# Altium project PROC154E3_SCH.PrjPcb (part 41 of 60)

## Sheet 46. QUAD PORT CONSOLE.SchDoc: QUAD PORT UART
size 513 x 386 mm; Project: PROC154E2(001)_SK_AM69; Issue: 1.0; RevCode: E3; Page Create Date: March  8, 1995; Variant Name: Core Design; Schematic Page Number: 46; Page Number: 46; Page Size: C; Comment: MISTRAL_TITLEBLK_CSIZE_1; Page Count: 62; Schematic Page Count: 62; Name: PROC154E2 001 SK AM69; DsnPath: C:\Users\danie\Downloads\sprr466c\PROC154E3_RP\PROC154E3_SCH.DSN; SchematicName: SCHEMATIC1; PageName: 46. QUAD PORT CONSOLE; PageSize: C; TopSchematic: True
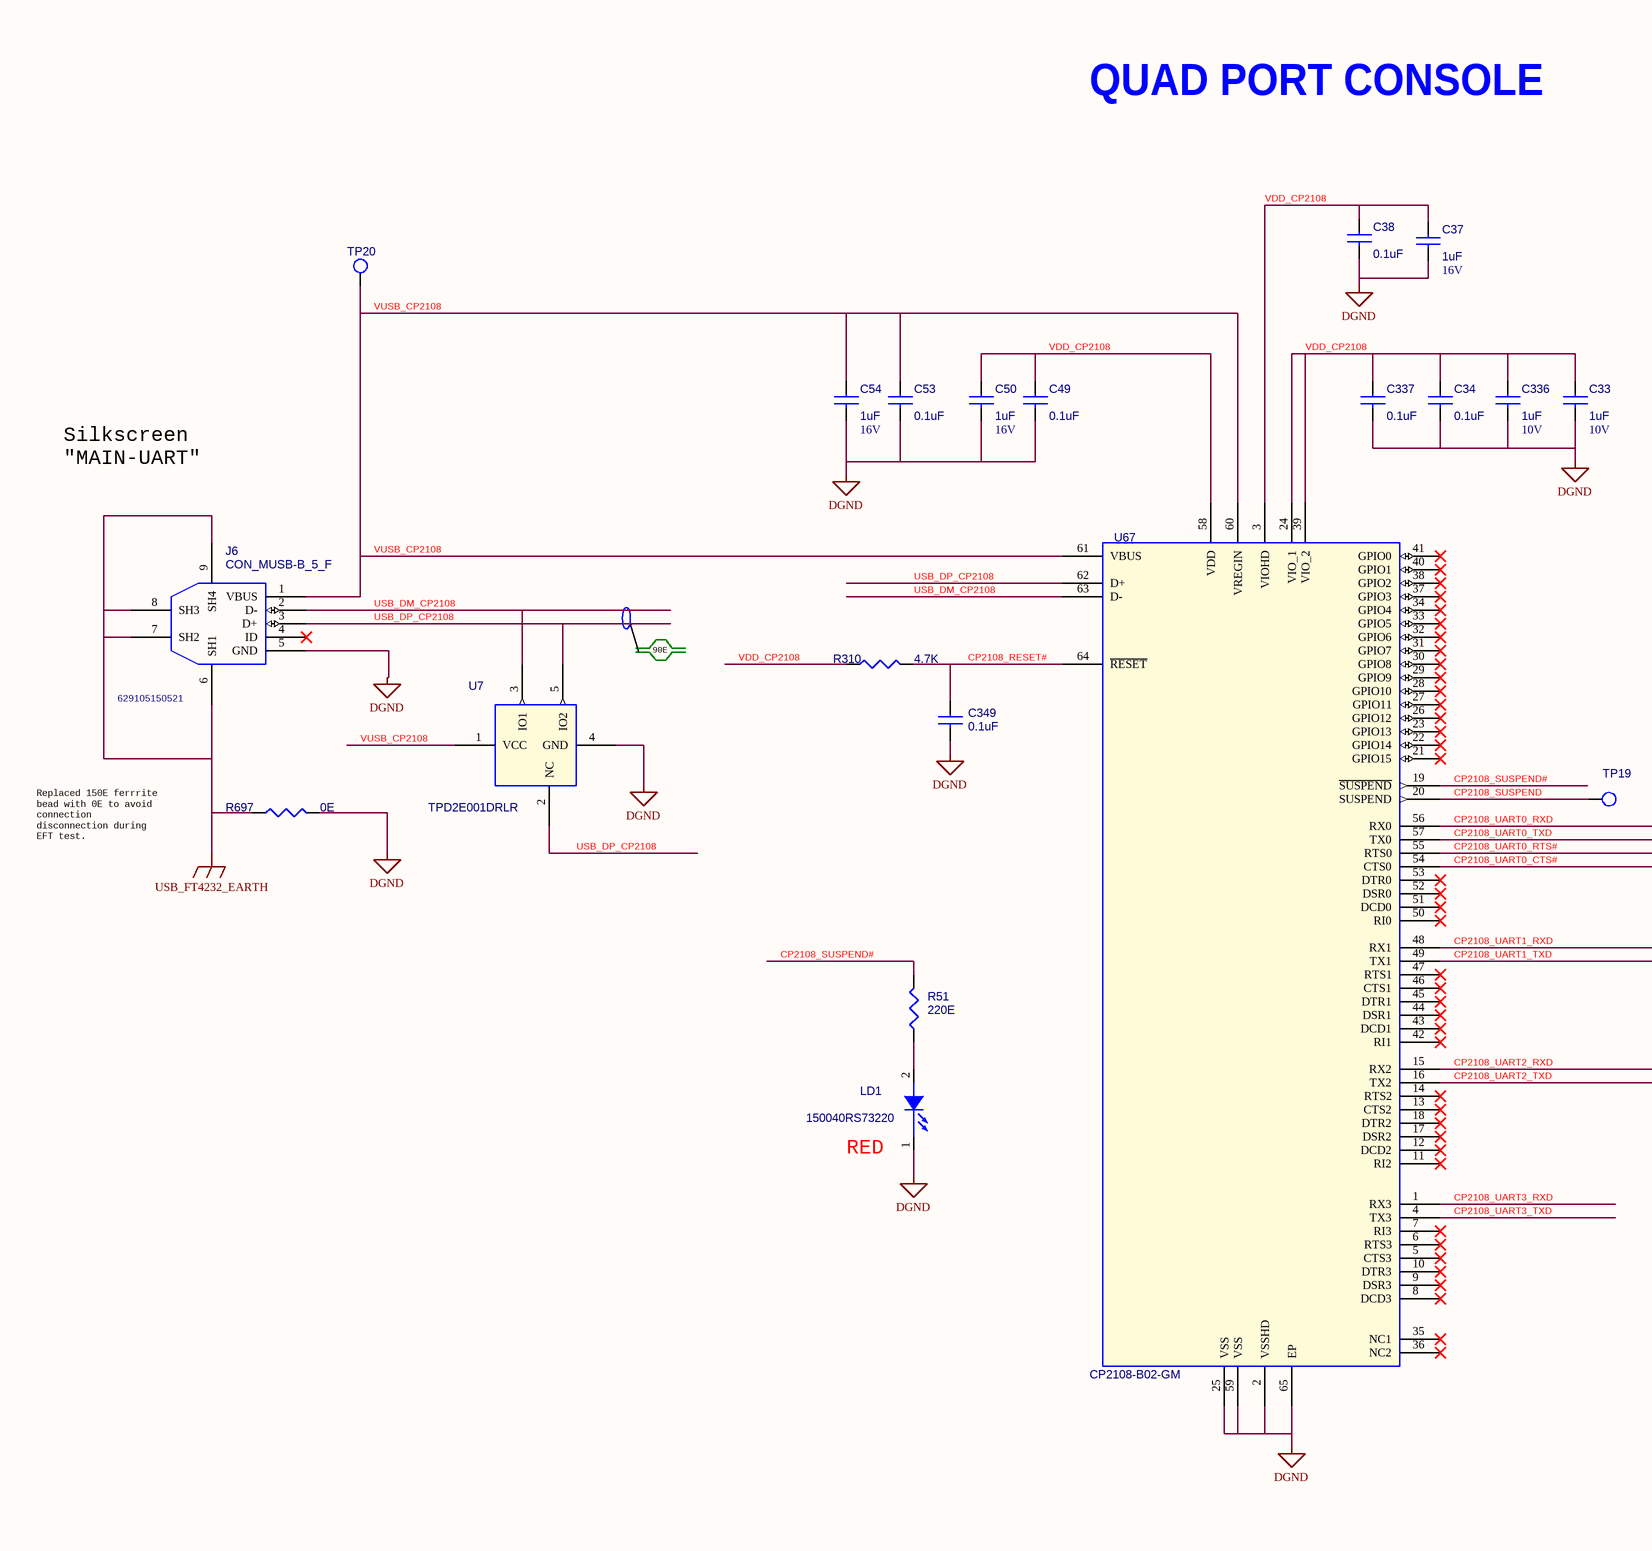
[diagram p76: 46. QUAD PORT CONSOLE.SchDoc, left]
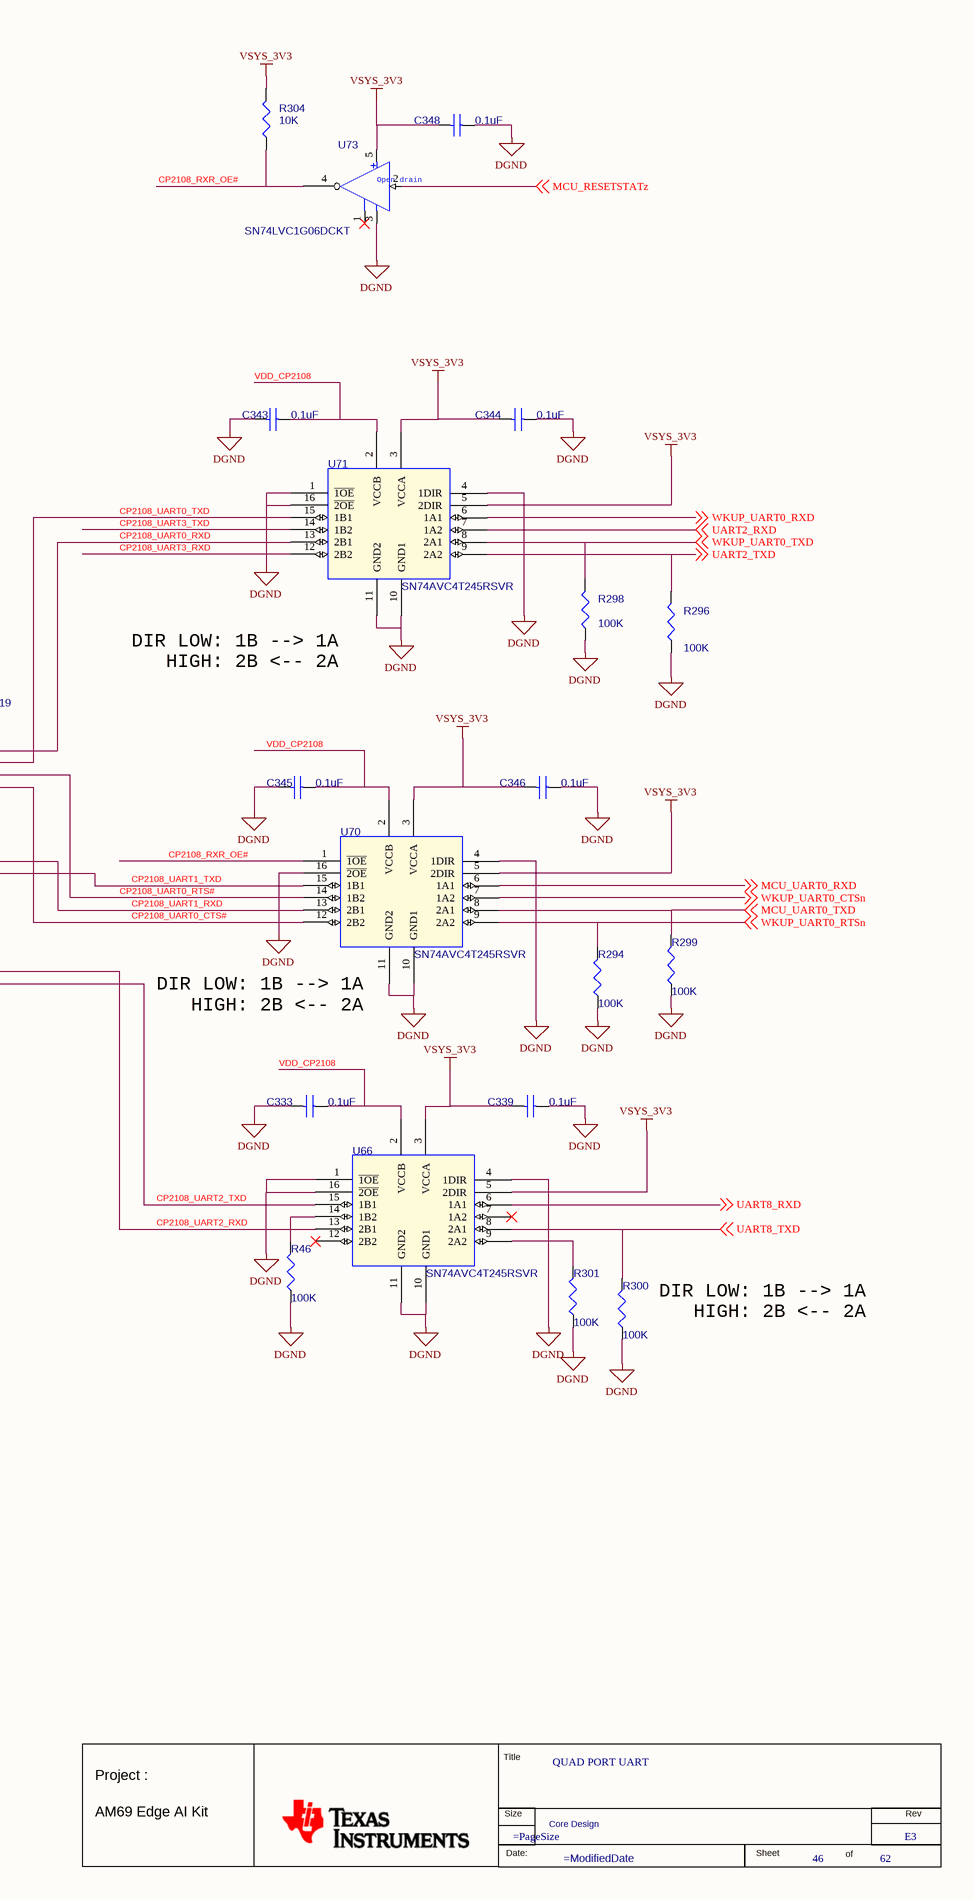
[diagram p77: 46. QUAD PORT CONSOLE.SchDoc, right]

### Parts
(Parts that share a designator on the sheet are numbered #1, #2 ... from top to bottom, then left to right.)
*#46  RevCode: E3  Title: QUAD PORT UART  Page Number: 46  Page Count: 62  Variant Name: Core Design  (hidden comment: MISTRAL_TITLEBLK_CSIZE_1)  (graphical)
C33  1uF  Voltage: 10V  [CAP0402_0-75]
C34  0.1uF  [CAP0201_0-5]
C37  1uF  Voltage: 16V  [CAP0201_0-5]
C38  0.1uF  [CAP0201_0-5]
C49  0.1uF  [CAP0201_0-5]
C50  1uF  Voltage: 16V  [CAP0201_0-5]
C53  0.1uF  [CAP0201_0-5]
C54  1uF  Voltage: 16V  [CAP0201_0-5]
C333  0.1uF  [CAP0201_0-5]
C336  1uF  Voltage: 10V  [CAP0402_0-75]
C337  0.1uF  [CAP0201_0-5]
C339  0.1uF  [CAP0201_0-5]
C343  0.1uF  [CAP0201_0-5]
C344  0.1uF  [CAP0201_0-5]
C345  0.1uF  [CAP0201_0-5]
C346  0.1uF  [CAP0201_0-5]
C348  0.1uF  [CAP0201_0-5]
C349  0.1uF  [CAP0201_0-5]
J6  CON_MUSB-B_5_F  Mfr_part_number: 629105150521  [CON_MUSBB5_629105150521_S_R_S_2-7]
LD1  150040RS73220  [LED_150040GS73220_40X20_SMD_0-4]
R46  100K  [RES0402_0-5]
R51  220E  [RES0402_0-5]
R294  100K  [RES0402_0-5]
R296  100K  [RES0402_0-5]
R298  100K  [RES0402_0-5]
R299  100K  [RES0402_0-5]
R300  100K  [RES0402_0-5]
R301  100K  [RES0402_0-5]
R304  10K  [RES0402_0-5]
R310  4.7K  [RES0201_0-5]
R697  0E  [RES0805_0-75]
TP19  TP30_SMD  [TP30_SMD]  (value not drawn)
TP20  TP30_SMD  [TP30_SMD]  (value not drawn)
U7  TPD2E001DRLR  [SOT553-5_0-6]
U66  SN74AVC4T245RSVR  [UQFN16_TMUX1574_70X100_0-6]
U67  CP2108-B02-GM  [QFN64_19-68_360X360]
U70  SN74AVC4T245RSVR  [UQFN16_TMUX1574_70X100_0-6]
U71  SN74AVC4T245RSVR  [UQFN16_TMUX1574_70X100_0-6]
U73  SN74LVC1G06DCKT  [SC70-5_1-1]

### Nets
DGND: C33.2 C34.2 C37.2 C38.2 C49.2 C50.2 C53.2 C54.2 C333.2 C336.2 C337.2 C339.1 C343.2 C344.1 C345.2 C346.1 C348.1 C349.2 J6.5(GND) LD1.1(CATHODE) R46.1 R294.1 R296.1 R298.1 R299.1 R300.1 R301.1 R697.2 U7.4(GND) U66.1(~{1OE}) U66.4(1DIR) U66.10(GND1) U66.11(GND2) U66.16(~{2OE}) U67.2(VSSHD) U67.25(VSS) U67.59(VSS) U67.65(EP) U70.4(1DIR) U70.10(GND1) U70.11(GND2) U70.16(~{2OE}) U71.1(~{1OE}) U71.4(1DIR) U71.10(GND1) U71.11(GND2) U71.16(~{2OE}) U73.3(GND)  [project net VDD_CPU_HCPS_GOSNS]
USB_FT4232_EARTH: J6.6(SH1) J6.7(SH2) J6.8(SH3) J6.9(SH4) R697.1
VSYS_3V3: C339.2 C344.2 C346.2 C348.2 R304.2 U66.3(VCCA) U66.5(2DIR) U70.3(VCCA) U70.5(2DIR) U71.3(VCCA) U71.5(2DIR) U73.5(VCC)  [project net V_3V3]
CP2108_RESET#: C349.1 R310.2 U67.64(~{RESET})
CP2108_RXR_OE#: R304.1 U70.1(~{1OE}) U73.4(OUT)
CP2108_SUSPEND: TP19.1(TP) U67.20(SUSPEND)
CP2108_SUSPEND#: R51.2 U67.19(~{SUSPEND})
CP2108_UART0_CTS#: U67.54(CTS0) U70.12(2B2)
CP2108_UART0_RTS#: U67.55(RTS0) U70.14(1B2)
CP2108_UART0_RXD: U67.56(RX0) U71.13(2B1)
CP2108_UART0_TXD: U67.57(TX0) U71.15(1B1)
CP2108_UART1_RXD: U67.48(RX1) U70.13(2B1)
CP2108_UART1_TXD: U67.49(TX1) U70.15(1B1)
CP2108_UART2_RXD: U66.13(2B1) U67.15(RX2)
CP2108_UART2_TXD: U66.15(1B1) U67.16(TX2)
CP2108_UART3_RXD: U67.1(RX3) U71.12(2B2)
CP2108_UART3_TXD: U67.4(TX3) U71.14(1B2)
MCU_RESETSTATZ: U73.2(IN_A) ; off-sheet MCU_RESETSTATz
MCU_UART0_RXD: U70.6(1A1) ; off-sheet MCU_UART0_RXD
MCU_UART0_TXD: R299.2 U70.8(2A1) ; off-sheet MCU_UART0_TXD
UART2_RXD: U71.7(1A2) ; off-sheet UART2_RXD
UART2_TXD: R296.2 U71.9(2A2) ; off-sheet UART2_TXD
UART8_RXD: U66.6(1A1) ; off-sheet UART8_RXD
UART8_TXD: R300.2 U66.8(2A1) ; off-sheet UART8_TXD
USB_DM_CP2108: J6.2(D-) U7.3(IO1) U67.63(D-)
USB_DP_CP2108: J6.3(D+) U7.2(NC) U7.5(IO2) U67.62(D+)
VDD_CP2108: C33.1 C34.1 C37.1 C38.1 C49.1 C50.1 C333.1 C336.1 C337.1 C343.1 C345.1 R310.1 U66.2(VCCB) U67.3(VIOHD) U67.24(VIO_1) U67.39(VIO_2) U67.58(VDD) U70.2(VCCB) U71.2(VCCB)
VUSB_CP2108: C53.1 C54.1 J6.1(VBUS) TP20.1(TP) U7.1(VCC) U67.60(VREGIN) U67.61(VBUS)
WKUP_UART0_CTSn: U70.7(1A2) ; off-sheet WKUP_UART0_CTSn
WKUP_UART0_RTSn: R294.2 U70.9(2A2) ; off-sheet WKUP_UART0_RTSn
WKUP_UART0_RXD: U71.6(1A1) ; off-sheet WKUP_UART0_RXD
WKUP_UART0_TXD: R298.2 U71.8(2A1) ; off-sheet WKUP_UART0_TXD
NetLD1_2: LD1.2(ANODE) R51.1
NetR46_2: R46.2 U66.14(1B2)
NetR301_2: R301.2 U66.9(2A2)

Not connected (* = marked no-connect by the designer): J6 4(ID)*; U66 7(1A2)* 12(2B2)*; U67 5(CTS3)* 6(RTS3)* 7(RI3)* 8(DCD3)* 9(DSR3)* 10(DTR3)* 11(RI2)* 12(DCD2)* 13(CTS2)* 14(RTS2)* 17(DSR2)* 18(DTR2)* 21(GPIO15)* 22(GPIO14)* 23(GPIO13)* 26(GPIO12)* 27(GPIO11)* 28(GPIO10)* 29(GPIO9)* 30(GPIO8)* 31(GPIO7)* 32(GPIO6)* 33(GPIO5)* 34(GPIO4)* 35(NC1)* 36(NC2)* 37(GPIO3)* 38(GPIO2)* 40(GPIO1)* 41(GPIO0)* 42(RI1)* 43(DCD1)* 44(DSR1)* 45(DTR1)* 46(CTS1)* 47(RTS1)* 50(RI0)* 51(DCD0)* 52(DSR0)* 53(DTR0)*; U73 1(NC)*

### Notes on the sheet
- QUAD PORT CONSOLE
- Silkscreen
  "MAIN-UART"
- 90E
- DIR LOW: 1B --> 1A
  HIGH: 2B <-- 2A
- Replaced 150E ferrrite
  bead with 0E to avoid
  connection
  disconnection during
  EFT test.
- (near U70) DIR LOW: 1B --> 1A
  HIGH: 2B <-- 2A
- (near LD1) RED
- (near R300) DIR LOW: 1B --> 1A
  HIGH: 2B <-- 2A
- (in symbol MISTRAL_TITLEBLK_CSIZE_1) Title; Project :; Size; Rev; AM69 Edge AI Kit; Date:; Sheet; of
- (in symbol SN74LVC1G06DCKT_SC70-5) Open drain

### Library data of the parts
*#46 = MISTRAL_TITLEBLK_CSIZE_1: as *#44 on sheet 44. SGMII EXPANSION HDR; Page Create Date: March  8, 1995; Page Size: =PageSize; Page Modify Date: =ModifiedDate; Schematic Page Count: 62; Schematic Page Number: 46
C33 = CAP_Dup1: CAP CERAMIC 1uF 10V 10% X7S AUTO 0402; Part Reference: C33; Part_type: CAPACITORS\CERAMIC; Mfr_part_number: GCM155C71A105KE38D; Mfr_name: MURATA; Mistral Part No: 120018090021-R; Custom_Duty: 15%; Customs_HS_Code: 85322990; Wattage: NA; Project: SMART-M_SCRIPTALK_PB; Value: 1uF; PCB Footprint: CAP0402_0-75; Chkd/date: MANIRAJA/100918; Crtd /date: ALVY/100918; Datasheet: Y:\MIS_DATABASE\DATASHEETS\CAPACITORS\MURATA-GCM-SER.PDF; Temperature: -55°C+125°C; Weight: 6mg; Height: 0.70MM; Distributor_part_number: 490-13409-1-ND; Distributor_name: DIGIKEY; Package: 0402; Tolerance: 10%; Library Ref: CAP; MECHANICAL 3D STEP FILE: CAP0402_0-75; Footprint Ref: CAP0402_0-75; Library Path: Y:\MIS_DATABASE\Library\ALTIUM_TOOL\SCHEMATICS_PARTS\MS_DISCRETE_Library.schlib; Footprint Path: Y:\MIS_DATABASE\Library\ALTIUM_TOOL\PCB_FOOTPRINTS\Altium_Footprint_Lib.PcbLib
C34 = CAP_Dup1: CAP CERAMIC 0.1uF 16V 10% X7S AUTO 0201; Part Reference: C34; Part_type: CAPACITORS\CERAMIC; Mfr_part_number: GRT033C71C104KE01D; Mfr_name: MURATA; Mistral Part No: 120021030007-R; Custom_Duty: 15%; Customs_HS_Code: 85322990; Wattage: NA; Project: J7ES_SK_BRD; Value: 0.1uF; PCB Footprint: CAP0201_0-5; MECHANICAL 3D STEP FILE: CAP0201_0-5; Chkd/date: MANIRAJA/110321; Crtd /date: ALVY/110321; Datasheet: Y:\MIS_DATABASE\DATASHEETS\CAPACITORS\GRT033C71C104KE01.PDF; Temperature: -55°C+125°C; Weight: 330mg; Height: 0.33MM; Distributor_part_number: 490-GRT033C71C104KE01DTR-ND; Distributor_name: DIGIKEY; Package: 0201; Voltage: 16V; Tolerance: 10%
C37 = CAP_Dup1: CAP CERAMIC 1uF 16V 20% X5R 0201; Part Reference: C37; Mistral Part No: 120018090038-R; Mfr_name: SAMSUNG; Mfr_part_number: CL03A105MO3NRNH; Part_type: CAPACITORS\CERAMIC; Project: TI_60GHz-AOP; Wattage: NA; Customs_HS_Code: 85322990; Custom_Duty: 15%; Value: 1uF; PCB Footprint: CAP0201_0-5; Footprint Path: Y:\MIS_DATABASE\Library\ALTIUM_TOOL\PCB_FOOTPRINTS\Altium_Footprint_Lib.PcbLib; Library Path: Y:\MIS_DATABASE\Library\ALTIUM_TOOL\SCHEMATICS_PARTS\MS_DISCRETE_Library.schlib; Footprint Ref: CAP0201_0-5; MECHANICAL 3D STEP FILE: CAP0201_0-5; Library Ref: CAP; Tolerance: 20%; Package: 0201; Distributor_name: DIGIKEY; Distributor_part_number: 1276-6798-1-ND; Height: 0.39MM; Weight: 0.17mg; Temperature: -55°C+85°C; Datasheet: Y:\MIS_DATABASE\DATASHEETS\CAPACITORS\CL03A105MO3NRNH.PDF; Crtd /date: MANIRAJA/220918; Chkd/date: MANIRAJA/220918
C38 = CAP_Dup1: CAP CERAMIC 0.1uF 16V 10% X7S AUTO 0201; Part Reference: C38; Part_type: CAPACITORS\CERAMIC; Mfr_part_number: GRT033C71C104KE01D; Mfr_name: MURATA; Mistral Part No: 120021030007-R; Custom_Duty: 15%; Customs_HS_Code: 85322990; Wattage: NA; Project: J7ES_SK_BRD; Value: 0.1uF; PCB Footprint: CAP0201_0-5; MECHANICAL 3D STEP FILE: CAP0201_0-5; Chkd/date: MANIRAJA/110321; Crtd /date: ALVY/110321; Datasheet: Y:\MIS_DATABASE\DATASHEETS\CAPACITORS\GRT033C71C104KE01.PDF; Temperature: -55°C+125°C; Weight: 330mg; Height: 0.33MM; Distributor_part_number: 490-GRT033C71C104KE01DTR-ND; Distributor_name: DIGIKEY; Package: 0201; Voltage: 16V; Tolerance: 10%
C49 = CAP_Dup1: CAP CERAMIC 0.1uF 16V 10% X7S AUTO 0201; Part Reference: C49; Part_type: CAPACITORS\CERAMIC; Mfr_part_number: GRT033C71C104KE01D; Mfr_name: MURATA; Mistral Part No: 120021030007-R; Custom_Duty: 15%; Customs_HS_Code: 85322990; Wattage: NA; Project: J7ES_SK_BRD; Value: 0.1uF; PCB Footprint: CAP0201_0-5; MECHANICAL 3D STEP FILE: CAP0201_0-5; Chkd/date: MANIRAJA/110321; Crtd /date: ALVY/110321; Datasheet: Y:\MIS_DATABASE\DATASHEETS\CAPACITORS\GRT033C71C104KE01.PDF; Temperature: -55°C+125°C; Weight: 330mg; Height: 0.33MM; Distributor_part_number: 490-GRT033C71C104KE01DTR-ND; Distributor_name: DIGIKEY; Package: 0201; Voltage: 16V; Tolerance: 10%
C50 = CAP_Dup1: CAP CERAMIC 1uF 16V 20% X5R 0201; Part Reference: C50; Mistral Part No: 120018090038-R; Mfr_name: SAMSUNG; Mfr_part_number: CL03A105MO3NRNH; Part_type: CAPACITORS\CERAMIC; Project: TI_60GHz-AOP; Wattage: NA; Customs_HS_Code: 85322990; Custom_Duty: 15%; Value: 1uF; PCB Footprint: CAP0201_0-5; Footprint Path: Y:\MIS_DATABASE\Library\ALTIUM_TOOL\PCB_FOOTPRINTS\Altium_Footprint_Lib.PcbLib; Library Path: Y:\MIS_DATABASE\Library\ALTIUM_TOOL\SCHEMATICS_PARTS\MS_DISCRETE_Library.schlib; Footprint Ref: CAP0201_0-5; MECHANICAL 3D STEP FILE: CAP0201_0-5; Library Ref: CAP; Tolerance: 20%; Package: 0201; Distributor_name: DIGIKEY; Distributor_part_number: 1276-6798-1-ND; Height: 0.39MM; Weight: 0.17mg; Temperature: -55°C+85°C; Datasheet: Y:\MIS_DATABASE\DATASHEETS\CAPACITORS\CL03A105MO3NRNH.PDF; Crtd /date: MANIRAJA/220918; Chkd/date: MANIRAJA/220918
C53 = CAP_Dup1: CAP CERAMIC 0.1uF 16V 10% X7S AUTO 0201; Part Reference: C53; Mistral Part No: 120021030007-R; Mfr_name: MURATA; Mfr_part_number: GRT033C71C104KE01D; Part_type: CAPACITORS\CERAMIC; Project: J7ES_SK_BRD; Wattage: NA; Customs_HS_Code: 85322990; Custom_Duty: 15%; Value: 0.1uF; PCB Footprint: CAP0201_0-5; Tolerance: 10%; Voltage: 16V; Package: 0201; Distributor_name: DIGIKEY; Distributor_part_number: 490-GRT033C71C104KE01DTR-ND; Height: 0.33MM; Weight: 330mg; Temperature: -55°C+125°C; Datasheet: Y:\MIS_DATABASE\DATASHEETS\CAPACITORS\GRT033C71C104KE01.PDF; Crtd /date: ALVY/110321; Chkd/date: MANIRAJA/110321; MECHANICAL 3D STEP FILE: CAP0201_0-5
C54 = CAP_Dup1: CAP CERAMIC 1uF 16V 20% X5R 0201; Part Reference: C54; Mistral Part No: 120018090038-R; Mfr_name: SAMSUNG; Mfr_part_number: CL03A105MO3NRNH; Part_type: CAPACITORS\CERAMIC; Project: TI_60GHz-AOP; Wattage: NA; Customs_HS_Code: 85322990; Custom_Duty: 15%; Value: 1uF; PCB Footprint: CAP0201_0-5; Footprint Path: Y:\MIS_DATABASE\Library\ALTIUM_TOOL\PCB_FOOTPRINTS\Altium_Footprint_Lib.PcbLib; Library Path: Y:\MIS_DATABASE\Library\ALTIUM_TOOL\SCHEMATICS_PARTS\MS_DISCRETE_Library.schlib; Footprint Ref: CAP0201_0-5; MECHANICAL 3D STEP FILE: CAP0201_0-5; Library Ref: CAP; Tolerance: 20%; Package: 0201; Distributor_name: DIGIKEY; Distributor_part_number: 1276-6798-1-ND; Height: 0.39MM; Weight: 0.17mg; Temperature: -55°C+85°C; Datasheet: Y:\MIS_DATABASE\DATASHEETS\CAPACITORS\CL03A105MO3NRNH.PDF; Crtd /date: MANIRAJA/220918; Chkd/date: MANIRAJA/220918
C333 = CAP_Dup1: CAP CERAMIC 0.1uF 16V 10% X7S AUTO 0201; Part Reference: C333; Part_type: CAPACITORS\CERAMIC; Mfr_part_number: GRT033C71C104KE01D; Mfr_name: MURATA; Mistral Part No: 120021030007-R; Custom_Duty: 15%; Customs_HS_Code: 85322990; Wattage: NA; Project: J7ES_SK_BRD; Value: 0.1uF; PCB Footprint: CAP0201_0-5; MECHANICAL 3D STEP FILE: CAP0201_0-5; Chkd/date: MANIRAJA/110321; Crtd /date: ALVY/110321; Datasheet: Y:\MIS_DATABASE\DATASHEETS\CAPACITORS\GRT033C71C104KE01.PDF; Temperature: -55°C+125°C; Weight: 330mg; Height: 0.33MM; Distributor_part_number: 490-GRT033C71C104KE01DTR-ND; Distributor_name: DIGIKEY; Package: 0201; Voltage: 16V; Tolerance: 10%
C336 = CAP_Dup1: CAP CERAMIC 1uF 10V 10% X7S AUTO 0402; Part Reference: C336; Part_type: CAPACITORS\CERAMIC; Mfr_part_number: GCM155C71A105KE38D; Mfr_name: MURATA; Mistral Part No: 120018090021-R; Custom_Duty: 15%; Customs_HS_Code: 85322990; Wattage: NA; Project: SMART-M_SCRIPTALK_PB; Value: 1uF; PCB Footprint: CAP0402_0-75; Chkd/date: MANIRAJA/100918; Crtd /date: ALVY/100918; Datasheet: Y:\MIS_DATABASE\DATASHEETS\CAPACITORS\MURATA-GCM-SER.PDF; Temperature: -55°C+125°C; Weight: 6mg; Height: 0.70MM; Distributor_part_number: 490-13409-1-ND; Distributor_name: DIGIKEY; Package: 0402; Tolerance: 10%; Library Ref: CAP; MECHANICAL 3D STEP FILE: CAP0402_0-75; Footprint Ref: CAP0402_0-75; Library Path: Y:\MIS_DATABASE\Library\ALTIUM_TOOL\SCHEMATICS_PARTS\MS_DISCRETE_Library.schlib; Footprint Path: Y:\MIS_DATABASE\Library\ALTIUM_TOOL\PCB_FOOTPRINTS\Altium_Footprint_Lib.PcbLib
C337 = CAP_Dup1: CAP CERAMIC 0.1uF 16V 10% X7S AUTO 0201; Part Reference: C337; Mistral Part No: 120021030007-R; Mfr_name: MURATA; Mfr_part_number: GRT033C71C104KE01D; Part_type: CAPACITORS\CERAMIC; Project: J7ES_SK_BRD; Wattage: NA; Customs_HS_Code: 85322990; Custom_Duty: 15%; Value: 0.1uF; PCB Footprint: CAP0201_0-5; Tolerance: 10%; Voltage: 16V; Package: 0201; Distributor_name: DIGIKEY; Distributor_part_number: 490-GRT033C71C104KE01DTR-ND; Height: 0.33MM; Weight: 330mg; Temperature: -55°C+125°C; Datasheet: Y:\MIS_DATABASE\DATASHEETS\CAPACITORS\GRT033C71C104KE01.PDF; Crtd /date: ALVY/110321; Chkd/date: MANIRAJA/110321; MECHANICAL 3D STEP FILE: CAP0201_0-5
C339 = CAP_Dup1: CAP CERAMIC 0.1uF 16V 10% X7S AUTO 0201; Part Reference: C339; Mistral Part No: 120021030007-R; Mfr_name: MURATA; Mfr_part_number: GRT033C71C104KE01D; Part_type: CAPACITORS\CERAMIC; Project: J7ES_SK_BRD; Wattage: NA; Customs_HS_Code: 85322990; Custom_Duty: 15%; Value: 0.1uF; PCB Footprint: CAP0201_0-5; Tolerance: 10%; Voltage: 16V; Package: 0201; Distributor_name: DIGIKEY; Distributor_part_number: 490-GRT033C71C104KE01DTR-ND; Height: 0.33MM; Weight: 330mg; Temperature: -55°C+125°C; Datasheet: Y:\MIS_DATABASE\DATASHEETS\CAPACITORS\GRT033C71C104KE01.PDF; Crtd /date: ALVY/110321; Chkd/date: MANIRAJA/110321; MECHANICAL 3D STEP FILE: CAP0201_0-5
C343 = CAP_Dup1: CAP CERAMIC 0.1uF 16V 10% X7S AUTO 0201; Part Reference: C343; Mistral Part No: 120021030007-R; Mfr_name: MURATA; Mfr_part_number: GRT033C71C104KE01D; Part_type: CAPACITORS\CERAMIC; Project: J7ES_SK_BRD; Wattage: NA; Customs_HS_Code: 85322990; Custom_Duty: 15%; Value: 0.1uF; PCB Footprint: CAP0201_0-5; Tolerance: 10%; Voltage: 16V; Package: 0201; Distributor_name: DIGIKEY; Distributor_part_number: 490-GRT033C71C104KE01DTR-ND; Height: 0.33MM; Weight: 330mg; Temperature: -55°C+125°C; Datasheet: Y:\MIS_DATABASE\DATASHEETS\CAPACITORS\GRT033C71C104KE01.PDF; Crtd /date: ALVY/110321; Chkd/date: MANIRAJA/110321; MECHANICAL 3D STEP FILE: CAP0201_0-5
C344 = CAP_Dup1: CAP CERAMIC 0.1uF 16V 10% X7S AUTO 0201; Part Reference: C344; Mistral Part No: 120021030007-R; Mfr_name: MURATA; Mfr_part_number: GRT033C71C104KE01D; Part_type: CAPACITORS\CERAMIC; Project: J7ES_SK_BRD; Wattage: NA; Customs_HS_Code: 85322990; Custom_Duty: 15%; Value: 0.1uF; PCB Footprint: CAP0201_0-5; Tolerance: 10%; Voltage: 16V; Package: 0201; Distributor_name: DIGIKEY; Distributor_part_number: 490-GRT033C71C104KE01DTR-ND; Height: 0.33MM; Weight: 330mg; Temperature: -55°C+125°C; Datasheet: Y:\MIS_DATABASE\DATASHEETS\CAPACITORS\GRT033C71C104KE01.PDF; Crtd /date: ALVY/110321; Chkd/date: MANIRAJA/110321; MECHANICAL 3D STEP FILE: CAP0201_0-5
C345 = CAP_Dup1: CAP CERAMIC 0.1uF 16V 10% X7S AUTO 0201; Part Reference: C345; Mistral Part No: 120021030007-R; Mfr_name: MURATA; Mfr_part_number: GRT033C71C104KE01D; Part_type: CAPACITORS\CERAMIC; Project: J7ES_SK_BRD; Wattage: NA; Customs_HS_Code: 85322990; Custom_Duty: 15%; Value: 0.1uF; PCB Footprint: CAP0201_0-5; Tolerance: 10%; Voltage: 16V; Package: 0201; Distributor_name: DIGIKEY; Distributor_part_number: 490-GRT033C71C104KE01DTR-ND; Height: 0.33MM; Weight: 330mg; Temperature: -55°C+125°C; Datasheet: Y:\MIS_DATABASE\DATASHEETS\CAPACITORS\GRT033C71C104KE01.PDF; Crtd /date: ALVY/110321; Chkd/date: MANIRAJA/110321; MECHANICAL 3D STEP FILE: CAP0201_0-5
C346 = CAP_Dup1: CAP CERAMIC 0.1uF 16V 10% X7S AUTO 0201; Part Reference: C346; Mistral Part No: 120021030007-R; Mfr_name: MURATA; Mfr_part_number: GRT033C71C104KE01D; Part_type: CAPACITORS\CERAMIC; Project: J7ES_SK_BRD; Wattage: NA; Customs_HS_Code: 85322990; Custom_Duty: 15%; Value: 0.1uF; PCB Footprint: CAP0201_0-5; Tolerance: 10%; Voltage: 16V; Package: 0201; Distributor_name: DIGIKEY; Distributor_part_number: 490-GRT033C71C104KE01DTR-ND; Height: 0.33MM; Weight: 330mg; Temperature: -55°C+125°C; Datasheet: Y:\MIS_DATABASE\DATASHEETS\CAPACITORS\GRT033C71C104KE01.PDF; Crtd /date: ALVY/110321; Chkd/date: MANIRAJA/110321; MECHANICAL 3D STEP FILE: CAP0201_0-5
C348 = CAP_Dup1: CAP CERAMIC 0.1uF 16V 10% X7S AUTO 0201; Part Reference: C348; Part_type: CAPACITORS\CERAMIC; Mfr_part_number: GRT033C71C104KE01D; Mfr_name: MURATA; Mistral Part No: 120021030007-R; Custom_Duty: 15%; Customs_HS_Code: 85322990; Wattage: NA; Project: J7ES_SK_BRD; Value: 0.1uF; PCB Footprint: CAP0201_0-5; MECHANICAL 3D STEP FILE: CAP0201_0-5; Chkd/date: MANIRAJA/110321; Crtd /date: ALVY/110321; Datasheet: Y:\MIS_DATABASE\DATASHEETS\CAPACITORS\GRT033C71C104KE01.PDF; Temperature: -55°C+125°C; Weight: 330mg; Height: 0.33MM; Distributor_part_number: 490-GRT033C71C104KE01DTR-ND; Distributor_name: DIGIKEY; Package: 0201; Voltage: 16V; Tolerance: 10%
C349 = CAP_Dup1: CAP CERAMIC 0.1uF 16V 10% X7S AUTO 0201; Part Reference: C349; Mistral Part No: 120021030007-R; Mfr_name: MURATA; Mfr_part_number: GRT033C71C104KE01D; Part_type: CAPACITORS\CERAMIC; Project: J7ES_SK_BRD; Wattage: NA; Customs_HS_Code: 85322990; Custom_Duty: 15%; Value: 0.1uF; PCB Footprint: CAP0201_0-5; Tolerance: 10%; Voltage: 16V; Package: 0201; Distributor_name: DIGIKEY; Distributor_part_number: 490-GRT033C71C104KE01DTR-ND; Height: 0.33MM; Weight: 330mg; Temperature: -55°C+125°C; Datasheet: Y:\MIS_DATABASE\DATASHEETS\CAPACITORS\GRT033C71C104KE01.PDF; Crtd /date: ALVY/110321; Chkd/date: MANIRAJA/110321; MECHANICAL 3D STEP FILE: CAP0201_0-5
J6 = CON_USB_MINI-B: CON MICRO USB TYPE B 5POS FEMALE RT SMD; Part Reference: J6; Part_type: CONNECTOR\USB; Mfr_name: WURTH ELECTRONICS; Mistral Part No: 150019050015-R; Custom_Duty: 24%; Customs_HS_Code: 85369090; Wattage: NA; Project: NEXTNAV_ALT-STATION_ATE_BRD; Value: CON_MUSB-B_5_F; PCB Footprint: CON_MUSBB5_629105150521_S_R_S_2-7; Footprint Path: Y:\MIS_DATABASE\Library\ALTIUM_TOOL\PCB_FOOTPRINTS\Altium_Footprint_Lib.PcbLib; Library Path: Y:\MIS_DATABASE\Library\ALTIUM_TOOL\SCHEMATICS_PARTS\MS_CONNECTOR_Library.schlib; MECHANICAL 3D STEP FILE: CON_MUSBB5_629105150521_S_R_S_2-7; Chkd/date: MANIRAJA/150519; Crtd /date: ALVY/150519; Datasheet: Y:\MIS_DATABASE\DATASHEETS\CONNECTORS\629105150521.PDF; Temperature: -40°C+85°C; Weight: 360mg; Height: 2.66MM; Library Ref: CON_USB_MINI-B; Distributor_part_number: 732-5960-1-ND; Distributor_name: DIGIKEY; Package: SMD; Voltage: NA; Tolerance: NA; Footprint Ref: CON_MUSBB5_629105150521_S_R_S_2-7
LD1 = DIODE_LED: DIODE LED RED SMD; Part Reference: LD1; Part_type: OPTO\LED; Mfr_name: WURTH ELECTRONICS; Mistral Part No: 130020090020-R; Custom_Duty: 24%; Customs_HS_Code: 85439000; Wattage: NA; Project: AM64X_SKEVM; Value: 150040RS73220; PCB Footprint: LED_150040GS73220_40X20_SMD_0-4; Footprint Path: Y:\MIS_DATABASE\Library\ALTIUM_TOOL\PCB_FOOTPRINTS\Altium_Footprint_Lib.PcbLib; Library Path: Y:\MIS_DATABASE\Library\ALTIUM_TOOL\SCHEMATICS_PARTS\MS_OPTO_Library.schlib; MECHANICAL 3D STEP FILE: LED_150040GS73220_40X20_SMD_0-4; Chkd/date: MANIRAJA/100920; Crtd /date: ALVY/100920; Datasheet: Y:\MIS_DATABASE\DATASHEETS\DISCRETES\LEDS\150040RS73220.PDF; Temperature: -40°C+85°C; Weight: 29.3mg; Height: 0.35MM; Footprint Ref: LED_150040GS73220_40X20_SMD_0-4; Library Ref: DIODE_LED; Distributor_part_number: 732-13422-1-ND; Distributor_name: DIGIKEY; Package: SMD; Voltage: NA; Tolerance: NA; Mfr_part_number: 150040RS73220
R46 = RESISTOR_Dup2: RES 100K 1/10W 5% 0402; Part Reference: R46; Mistral Part No: 110009030177-R; Mfr_name: PANASONIC-ECG; Mfr_part_number: ERJ-2GEJ104X; Part_type: RESISTORS\FIXED; Project: RED EYE; Voltage: NA; Customs_HS_Code: 85332119; Custom_Duty: 15%; Value: 100K; Footprint Path: Y:\MIS_DATABASE\Library\ALTIUM_TOOL\PCB_FOOTPRINTS\Altium_Footprint_Lib.PcbLib; Library Path: Y:\MIS_DATABASE\Library\ALTIUM_TOOL\SCHEMATICS_PARTS\MS_DISCRETE_Library.schlib; MECHANICAL 3D STEP FILE: RES0402_0-5; Footprint Ref: RES0402_0-5; Tolerance: 5%; Wattage: 1/10W; Package: 0402; Distributor_name: DIGIKEY; Distributor_part_number: P100KJCT-ND; Height: 0.40MM; Weight: 0.8mg; Temperature: -55°C+155°C; Datasheet: Y:\MIS_DATABASE\DATASHEETS\RESISTORS\PAN-ERJSER_NOV17.PDF; Crtd /date: GEETHA/190406; Chkd/date: VASANTHA/291216; Library Ref: RESISTOR; PCB Footprint: RES0402_0-5
R51 = RESISTOR_Dup2: RES 220E 1/16W 5% 0402; Part Reference: R51; Mistral Part No: 110020120013-R; Mfr_name: YAGEO AMERICA; Mfr_part_number: RC0402JR-07220RL; Part_type: RESISTORS\FIXED; Project: TI_AM243x LP EVM; Voltage: NA; Customs_HS_Code: 85332119; Custom_Duty: 15%; Value: 220E; PCB Footprint: RES0402_0-5; Library Ref: RESISTOR; Tolerance: 5%; Wattage: 1/16W; Package: 0402; Distributor_name: DIGIKEY; Distributor_part_number: 311-220JRCT-ND; Height: 0.40MM; Weight: 0.65mg; Temperature: -55°C+155°C; Datasheet: Y:\MIS_DATABASE\DATASHEETS\RESISTORS\RCXXXXL-SER_MAR18.PDF; Crtd /date: MANIRAJA/091220; Chkd/date: ALVY/091220; MECHANICAL 3D STEP FILE: RES0402_0-5; Footprint Ref: RES0402_0-5; Library Path: Y:\MIS_DATABASE\Library\ALTIUM_TOOL\SCHEMATICS_PARTS\MS_DISCRETE_Library.schlib; Footprint Path: Y:\MIS_DATABASE\Library\ALTIUM_TOOL\PCB_FOOTPRINTS\Altium_Footprint_Lib.PcbLib
R294 = RESISTOR_Dup2: RES 100K 1/10W 5% 0402; Part Reference: R294; Mistral Part No: 110009030177-R; Mfr_name: PANASONIC-ECG; Mfr_part_number: ERJ-2GEJ104X; Part_type: RESISTORS\FIXED; Project: RED EYE; Voltage: NA; Customs_HS_Code: 85332119; Custom_Duty: 15%; Value: 100K; Footprint Path: Y:\MIS_DATABASE\Library\ALTIUM_TOOL\PCB_FOOTPRINTS\Altium_Footprint_Lib.PcbLib; Library Path: Y:\MIS_DATABASE\Library\ALTIUM_TOOL\SCHEMATICS_PARTS\MS_DISCRETE_Library.schlib; MECHANICAL 3D STEP FILE: RES0402_0-5; Footprint Ref: RES0402_0-5; Tolerance: 5%; Wattage: 1/10W; Package: 0402; Distributor_name: DIGIKEY; Distributor_part_number: P100KJCT-ND; Height: 0.40MM; Weight: 0.8mg; Temperature: -55°C+155°C; Datasheet: Y:\MIS_DATABASE\DATASHEETS\RESISTORS\PAN-ERJSER_NOV17.PDF; Crtd /date: GEETHA/190406; Chkd/date: VASANTHA/291216; Library Ref: RESISTOR; PCB Footprint: RES0402_0-5
R296 = RESISTOR_Dup2: RES 100K 1/10W 5% 0402; Part Reference: R296; Part_type: RESISTORS\FIXED; Mfr_part_number: ERJ-2GEJ104X; Mfr_name: PANASONIC-ECG; Mistral Part No: 110009030177-R; Custom_Duty: 15%; Customs_HS_Code: 85332119; Voltage: NA; Project: RED EYE; Value: 100K; Library Ref: RESISTOR; Chkd/date: VASANTHA/291216; Crtd /date: GEETHA/190406; Datasheet: Y:\MIS_DATABASE\DATASHEETS\RESISTORS\PAN-ERJSER_NOV17.PDF; Temperature: -55°C+155°C; Weight: 0.8mg; Height: 0.40MM; Distributor_part_number: P100KJCT-ND; Distributor_name: DIGIKEY; Package: 0402; Wattage: 1/10W; Tolerance: 5%; Footprint Ref: RES0402_0-5; MECHANICAL 3D STEP FILE: RES0402_0-5; Library Path: Y:\MIS_DATABASE\Library\ALTIUM_TOOL\SCHEMATICS_PARTS\MS_DISCRETE_Library.schlib; Footprint Path: Y:\MIS_DATABASE\Library\ALTIUM_TOOL\PCB_FOOTPRINTS\Altium_Footprint_Lib.PcbLib; PCB Footprint: RES0402_0-5
R298 = RESISTOR_Dup2: RES 100K 1/10W 5% 0402; Part Reference: R298; Mistral Part No: 110009030177-R; Mfr_name: PANASONIC-ECG; Mfr_part_number: ERJ-2GEJ104X; Part_type: RESISTORS\FIXED; Project: RED EYE; Voltage: NA; Customs_HS_Code: 85332119; Custom_Duty: 15%; Value: 100K; Footprint Path: Y:\MIS_DATABASE\Library\ALTIUM_TOOL\PCB_FOOTPRINTS\Altium_Footprint_Lib.PcbLib; Library Path: Y:\MIS_DATABASE\Library\ALTIUM_TOOL\SCHEMATICS_PARTS\MS_DISCRETE_Library.schlib; MECHANICAL 3D STEP FILE: RES0402_0-5; Footprint Ref: RES0402_0-5; Tolerance: 5%; Wattage: 1/10W; Package: 0402; Distributor_name: DIGIKEY; Distributor_part_number: P100KJCT-ND; Height: 0.40MM; Weight: 0.8mg; Temperature: -55°C+155°C; Datasheet: Y:\MIS_DATABASE\DATASHEETS\RESISTORS\PAN-ERJSER_NOV17.PDF; Crtd /date: GEETHA/190406; Chkd/date: VASANTHA/291216; Library Ref: RESISTOR; PCB Footprint: RES0402_0-5
R299 = RESISTOR_Dup2: RES 100K 1/10W 5% 0402; Part Reference: R299; Mistral Part No: 110009030177-R; Mfr_name: PANASONIC-ECG; Mfr_part_number: ERJ-2GEJ104X; Part_type: RESISTORS\FIXED; Project: RED EYE; Voltage: NA; Customs_HS_Code: 85332119; Custom_Duty: 15%; Value: 100K; Footprint Path: Y:\MIS_DATABASE\Library\ALTIUM_TOOL\PCB_FOOTPRINTS\Altium_Footprint_Lib.PcbLib; Library Path: Y:\MIS_DATABASE\Library\ALTIUM_TOOL\SCHEMATICS_PARTS\MS_DISCRETE_Library.schlib; MECHANICAL 3D STEP FILE: RES0402_0-5; Footprint Ref: RES0402_0-5; Tolerance: 5%; Wattage: 1/10W; Package: 0402; Distributor_name: DIGIKEY; Distributor_part_number: P100KJCT-ND; Height: 0.40MM; Weight: 0.8mg; Temperature: -55°C+155°C; Datasheet: Y:\MIS_DATABASE\DATASHEETS\RESISTORS\PAN-ERJSER_NOV17.PDF; Crtd /date: GEETHA/190406; Chkd/date: VASANTHA/291216; Library Ref: RESISTOR; PCB Footprint: RES0402_0-5
R300 = RESISTOR_Dup2: RES 100K 1/10W 5% 0402; Part Reference: R300; Mistral Part No: 110009030177-R; Mfr_name: PANASONIC-ECG; Mfr_part_number: ERJ-2GEJ104X; Part_type: RESISTORS\FIXED; Project: RED EYE; Voltage: NA; Customs_HS_Code: 85332119; Custom_Duty: 15%; Value: 100K; Footprint Path: Y:\MIS_DATABASE\Library\ALTIUM_TOOL\PCB_FOOTPRINTS\Altium_Footprint_Lib.PcbLib; Library Path: Y:\MIS_DATABASE\Library\ALTIUM_TOOL\SCHEMATICS_PARTS\MS_DISCRETE_Library.schlib; MECHANICAL 3D STEP FILE: RES0402_0-5; Footprint Ref: RES0402_0-5; Tolerance: 5%; Wattage: 1/10W; Package: 0402; Distributor_name: DIGIKEY; Distributor_part_number: P100KJCT-ND; Height: 0.40MM; Weight: 0.8mg; Temperature: -55°C+155°C; Datasheet: Y:\MIS_DATABASE\DATASHEETS\RESISTORS\PAN-ERJSER_NOV17.PDF; Crtd /date: GEETHA/190406; Chkd/date: VASANTHA/291216; Library Ref: RESISTOR; PCB Footprint: RES0402_0-5
R301 = RESISTOR_Dup2: RES 100K 1/10W 5% 0402; Part Reference: R301; Mistral Part No: 110009030177-R; Mfr_name: PANASONIC-ECG; Mfr_part_number: ERJ-2GEJ104X; Part_type: RESISTORS\FIXED; Project: RED EYE; Voltage: NA; Customs_HS_Code: 85332119; Custom_Duty: 15%; Value: 100K; Footprint Path: Y:\MIS_DATABASE\Library\ALTIUM_TOOL\PCB_FOOTPRINTS\Altium_Footprint_Lib.PcbLib; Library Path: Y:\MIS_DATABASE\Library\ALTIUM_TOOL\SCHEMATICS_PARTS\MS_DISCRETE_Library.schlib; MECHANICAL 3D STEP FILE: RES0402_0-5; Footprint Ref: RES0402_0-5; Tolerance: 5%; Wattage: 1/10W; Package: 0402; Distributor_name: DIGIKEY; Distributor_part_number: P100KJCT-ND; Height: 0.40MM; Weight: 0.8mg; Temperature: -55°C+155°C; Datasheet: Y:\MIS_DATABASE\DATASHEETS\RESISTORS\PAN-ERJSER_NOV17.PDF; Crtd /date: GEETHA/190406; Chkd/date: VASANTHA/291216; Library Ref: RESISTOR; PCB Footprint: RES0402_0-5
R304 = RESISTOR_Dup2: RES 10K 1/16W 5% 0402; Part Reference: R304; Part_type: RESISTORS\FIXED; Mfr_part_number: RC0402JR-0710KL; Mfr_name: YAGEO AMERICA; Mistral Part No: 110011060021-R; Custom_Duty: 15%; Customs_HS_Code: 85332119; Voltage: NA; Project: HSE; Value: 10K; PCB Footprint: RES0402_0-5; MECHANICAL 3D STEP FILE: RES0402_0-5; Chkd/date: VASANTHA/061216; Crtd /date: MAZHAR/230805; Datasheet: Y:\MIS_DATABASE\DATASHEETS\RESISTORS\RCXXXXL-SER_MAR18.PDF; Temperature: -55°C+155°C; Weight: 0.65mg; Height: 0.40MM; Distributor_part_number: 311-10KJRCT-ND; Distributor_name: DIGIKEY; Package: 0402; Wattage: 1/16W; Tolerance: 5%; Library Ref: RESISTOR; Footprint Ref: RES0402_0-5; Library Path: Y:\MIS_DATABASE\Library\ALTIUM_TOOL\SCHEMATICS_PARTS\MS_DISCRETE_Library.schlib; Footprint Path: Y:\MIS_DATABASE\Library\ALTIUM_TOOL\PCB_FOOTPRINTS\Altium_Footprint_Lib.PcbLib
R310 = RESISTOR_Dup2: RES 4.7K 1/20W 5% 0201; Part Reference: R310; Mistral Part No: 110010070061-R; Mfr_name: PANASONIC-ECG; Mfr_part_number: ERJ-1GNJ472C; Part_type: RESISTORS\FIXED; Project: CUSTOM DCA1000; Voltage: NA; Customs_HS_Code: 85332119; Custom_Duty: 15%; Value: 4.7K; PCB Footprint: RES0201_0-5; MECHANICAL 3D STEP FILE: RES0201_0-5; Tolerance: 5%; Wattage: 1/20W; Package: 0201; Distributor_name: DIGIKEY; Distributor_part_number: P4.7AECT-ND; Height: 0.26MM; Weight: 0.15mg; Temperature: -55°C+125°C; Datasheet: Y:\MIS_DATABASE\DATASHEETS\RESISTORS\PAN-ERJSER_NOV17.PDF; Crtd /date: ALVY/170420; Chkd/date: MANIRAJA/170420; Library Ref: RESISTOR; Footprint Ref: RES0201_0-5; Library Path: Y:\MIS_DATABASE\Library\ALTIUM_TOOL\SCHEMATICS_PARTS\MS_DISCRETE_Library.schlib; Footprint Path: Y:\MIS_DATABASE\Library\ALTIUM_TOOL\PCB_FOOTPRINTS\Altium_Footprint_Lib.PcbLib
R697 = RESISTOR_Dup2: RES 0E 1/8W 5% 0805; Part Reference: R697; Mistral Part No: 110009030074-R; Mfr_name: YAGEO AMERICA; Mfr_part_number: RC0805JR-070RL; Part_type: RESISTORS\FIXED; Project: ZK_BIOMETRIC; Voltage: NA; Customs_HS_Code: 85332119; Custom_Duty: 15%; Value: 0E; Footprint Ref: RES0805_0-75; Tolerance: 5%; Wattage: 1/8W; Package: 0805; Distributor_name: DIGIKEY; Distributor_part_number: 311-0.0ARCT-ND; Library Ref: RESISTOR; Height: 0.60MM; Weight: 5.5mg; Temperature: -55°C+155°C; Datasheet: Y:\MIS_DATABASE\DATASHEETS\RESISTORS\RCXXXXL-SER_MAR18.PDF; Crtd /date: JEBRAN/020316; Chkd/date: VASANTHA/130416; MECHANICAL 3D STEP FILE: RES0805_0-75; Library Path: Y:\MIS_DATABASE\Library\ALTIUM_TOOL\SCHEMATICS_PARTS\MS_DISCRETE_Library.schlib; Footprint Path: Y:\MIS_DATABASE\Library\ALTIUM_TOOL\PCB_FOOTPRINTS\Altium_Footprint_Lib.PcbLib; PCB Footprint: RES0805_0-75
TP19 = TESTPOINT_Dup1: TESTPOINT CIR 30 SMD; Part Reference: TP19; Mistral Part No: 130009030930; Mfr_name: LOCAL; Custom_Duty: NA; Project: BT MODULE_CSRBC04; Value: TP30_SMD; PCB Footprint: TP30_SMD; Customs_HS_Code: NA; Footprint Ref: TP30_SMD; Library Ref: TESTPOINT; MECHANICAL 3D STEP FILE: NA; Datasheet: NA; Temperature: NA; Weight: NA; Wattage: NA; Voltage: NA; Tolerance: NA; Mfr_part_number: TP30_SMD; Part_type: TESTPOINT; Package: SMD; Distributor_name: NA; Distributor_part_number: NA; Height: NA; Crtd /date: MAZHAR/171006; Chkd/date: SHREESHAIL/171006; Library Path: Y:\MIS_DATABASE\Library\ALTIUM_TOOL\SCHEMATICS_PARTS\MS_DISCRETE_Library.schlib; Footprint Path: Y:\MIS_DATABASE\Library\ALTIUM_TOOL\PCB_FOOTPRINTS\Altium_Footprint_Lib.PcbLib; RoHS: NA
TP20 = TESTPOINT_Dup1: TESTPOINT CIR 30 SMD; Part Reference: TP20; Mistral Part No: 130009030930; Mfr_name: LOCAL; Custom_Duty: NA; Project: BT MODULE_CSRBC04; Value: TP30_SMD; PCB Footprint: TP30_SMD; Customs_HS_Code: NA; Footprint Ref: TP30_SMD; Library Ref: TESTPOINT; MECHANICAL 3D STEP FILE: NA; Datasheet: NA; Temperature: NA; Weight: NA; Wattage: NA; Voltage: NA; Tolerance: NA; Mfr_part_number: TP30_SMD; Part_type: TESTPOINT; Package: SMD; Distributor_name: NA; Distributor_part_number: NA; Height: NA; Crtd /date: MAZHAR/171006; Chkd/date: SHREESHAIL/171006; Library Path: Y:\MIS_DATABASE\Library\ALTIUM_TOOL\SCHEMATICS_PARTS\MS_DISCRETE_Library.schlib; Footprint Path: Y:\MIS_DATABASE\Library\ALTIUM_TOOL\PCB_FOOTPRINTS\Altium_Footprint_Lib.PcbLib; RoHS: NA
U7 = TPD2E001DRLR_SOT-5_1: IC ESD-PROTECTION DIODE ARRAYS SOT-5; Part Reference: U7; Mistral Part No: 140110060007-R; Mfr_name: TEXAS INSTRUMENTS; Part_type: ICS\ANALOG\ACTIVE FILTER; Automotive Alternate_mfr_part_number: TPD2E001IDRLRQ1; Project: CENTAURUS; Customs_HS_Code: 85423100; Custom_Duty: 15%; Tolerance: NA; Value: TPD2E001DRLR; PCB Footprint: SOT553-5_0-6; Footprint Ref: SOT553-5_0-6; Library Ref: TPD2E001DRLR_SOT-5; Mfr_part_number: TPD2E001DRLR; Package: SOT-5; Distributor_name: DIGIKEY; Distributor_part_number: 296-21883-1-ND; Height: 0.60MM; Weight: 2.8mg; Temperature: -40°C+85°C; Datasheet: Y:\MIS_DATABASE\DATASHEETS\ICS\MISC\TPD2E001DRLR.PDF; Crtd /date: MUDDU/250510; Chkd/date: NAVEED/150714; Voltage: NA; Wattage: NA; MECHANICAL 3D STEP FILE: SOT553-5_0-6; Library Path: Y:\MIS_DATABASE\Library\ALTIUM_TOOL\SCHEMATICS_PARTS\MS_FILTER_Library.schlib; Footprint Path: Y:\MIS_DATABASE\Library\ALTIUM_TOOL\PCB_FOOTPRINTS\Altium_Footprint_Lib.PcbLib; Automotive Alternate_mfr_name: TEXAS INSTRUMENTS
U66 = SN74AVC4T245RSV_UQFN16: IC 2-BIT BUS TRANSCEIVER WITH CONFIGURABLE VOLTAGE TRANSLATION AND 3 STATE O/P UQFN16; Part Reference: U66; Part_type: ICS\DIGITAL\BUSTRANSCEIVER; Mfr_name: TEXAS INSTRUMENTS; Mistral Part No: 141011040011-R; Custom_Duty: 15%; Customs_HS_Code: 85423100; Wattage: NA; Project: HMC; Value: SN74AVC4T245RSVR; PCB Footprint: UQFN16_TMUX1574_70X100_0-6; Footprint Path: Y:\MIS_DATABASE\Library\ALTIUM_TOOL\PCB_FOOTPRINTS\Altium_Footprint_Lib.PcbLib; Library Path: Y:\MIS_DATABASE\Library\ALTIUM_TOOL\SCHEMATICS_PARTS\MS_BUSDRIVERTRANSCEIVER_Library.schlib; MECHANICAL 3D STEP FILE: UQFN16_TMUX1574_70X100_0-6; Chkd/date: MANIRAJA/040520; Crtd /date: BAVISH/190411; Datasheet: Y:\MIS_DATABASE\DATASHEETS\ICS\DIGITAL\BUSTRANSCEIVER\SN74AVC4T245-SER.PDF; Temperature: -40°C+85°C; Weight: 41mg; Height: 0.55MM; Library Ref: SN74AVC4T245RSV_UQFN16; Distributor_part_number: 296-24366-1-ND; Distributor_name: DIGIKEY; Package: UQFN16; Voltage: NA; Tolerance: NA; Mfr_part_number: SN74AVC4T245RSVR; Footprint Ref: UQFN16_TMUX1574_70X100_0-6
U67 = CP2108-B02-GM_QFN64: IC SINGLE CHIP USB TO QUAD UART BRIDGE QFN64; Part Reference: U67; Mistral Part No: 141016060004-R; Mfr_name: SILICON LABS; Part_type: ICS\DIGITAL\PERIPHERAL; Project: NTR_GPSDO BOX CARD; Tolerance: NA; Customs_HS_Code: 85423100; Custom_Duty: 15%; Value: CP2108-B02-GM; Mfr_part_number: CP2108-B02-GM; Voltage: NA; Wattage: NA; Package: QFN64; Distributor_name: DIGIKEY; Distributor_part_number: 336-3020-ND; Library Ref: CP2108-B02-GM_QFN64; Height: 0.90MM; Weight: NA; Temperature: -40°C+85°C; Datasheet: Y:\MIS_DATABASE\DATASHEETS\ICS\DIGITAL\PERIPHERAL\CP2108-B02-GM.PDF; Crtd /date: VASANTHA/200616; Chkd/date: VASANTHA/200616; PCB Footprint: QFN64_19-68_360X360
U70 = SN74AVC4T245RSV_UQFN16: IC 2-BIT BUS TRANSCEIVER WITH CONFIGURABLE VOLTAGE TRANSLATION AND 3 STATE O/P UQFN16; Part Reference: U70; Mistral Part No: 141011040011-R; Mfr_name: TEXAS INSTRUMENTS; Part_type: ICS\DIGITAL\BUSTRANSCEIVER; Project: HMC; Tolerance: NA; Customs_HS_Code: 85423100; Custom_Duty: 15%; Value: SN74AVC4T245RSVR; Footprint Ref: UQFN16_TMUX1574_70X100_0-6; Mfr_part_number: SN74AVC4T245RSVR; Voltage: NA; Wattage: NA; Package: UQFN16; Distributor_name: DIGIKEY; Distributor_part_number: 296-24366-1-ND; Library Ref: SN74AVC4T245RSV_UQFN16; Height: 0.55MM; Weight: 41mg; Temperature: -40°C+85°C; Datasheet: Y:\MIS_DATABASE\DATASHEETS\ICS\DIGITAL\BUSTRANSCEIVER\SN74AVC4T245-SER.PDF; Crtd /date: BAVISH/190411; Chkd/date: MANIRAJA/040520; MECHANICAL 3D STEP FILE: UQFN16_TMUX1574_70X100_0-6; Library Path: Y:\MIS_DATABASE\Library\ALTIUM_TOOL\SCHEMATICS_PARTS\MS_BUSDRIVERTRANSCEIVER_Library.schlib; Footprint Path: Y:\MIS_DATABASE\Library\ALTIUM_TOOL\PCB_FOOTPRINTS\Altium_Footprint_Lib.PcbLib; PCB Footprint: UQFN16_TMUX1574_70X100_0-6
U71 = SN74AVC4T245RSV_UQFN16: IC 2-BIT BUS TRANSCEIVER WITH CONFIGURABLE VOLTAGE TRANSLATION AND 3 STATE O/P UQFN16; Part Reference: U71; Part_type: ICS\DIGITAL\BUSTRANSCEIVER; Mfr_name: TEXAS INSTRUMENTS; Mistral Part No: 141011040011-R; Custom_Duty: 15%; Customs_HS_Code: 85423100; Wattage: NA; Project: HMC; Value: SN74AVC4T245RSVR; Footprint Path: Y:\MIS_DATABASE\Library\ALTIUM_TOOL\PCB_FOOTPRINTS\Altium_Footprint_Lib.PcbLib; Library Path: Y:\MIS_DATABASE\Library\ALTIUM_TOOL\SCHEMATICS_PARTS\MS_BUSDRIVERTRANSCEIVER_Library.schlib; MECHANICAL 3D STEP FILE: UQFN16_TMUX1574_70X100_0-6; Chkd/date: MANIRAJA/040520; Crtd /date: BAVISH/190411; Datasheet: Y:\MIS_DATABASE\DATASHEETS\ICS\DIGITAL\BUSTRANSCEIVER\SN74AVC4T245-SER.PDF; Temperature: -40°C+85°C; Weight: 41mg; Height: 0.55MM; Library Ref: SN74AVC4T245RSV_UQFN16; Distributor_part_number: 296-24366-1-ND; Distributor_name: DIGIKEY; Package: UQFN16; Voltage: NA; Tolerance: NA; Mfr_part_number: SN74AVC4T245RSVR; Footprint Ref: UQFN16_TMUX1574_70X100_0-6; PCB Footprint: UQFN16_TMUX1574_70X100_0-6
U73 = SN74LVC1G06DCKT_SC70-5: IC SINGLE INVERTER BUFFER/DRIVER WITH OPEN-DRAIN OUTPUT SC70-5; Part Reference: U73; Mistral Part No: 141009030132-R; Mfr_name: TEXAS INSTRUMENTS; Part_type: ICS\DIGITAL\COMBINATIONAL; Project: OMAP2430_OSK; Tolerance: NA; Junction to Board °C/W: 70.9; Junction to Case °C/W: 178.9; Customs_HS_Code: 85423100; Custom_Duty: 15%; Value: SN74LVC1G06DCKT; PCB Footprint: SC70-5_1-1; Footprint Ref: SC70-5_1-1; Mfr_part_number: SN74LVC1G06DCKT; Voltage: NA; Wattage: NA; Package: SC70-5; Distributor_name: DIGIKEY; Distributor_part_number: 296-32290-1-ND; Library Ref: SN74LVC1G06DCKT_SC70-5; Height: 1.10MM; Weight: 20mg; Temperature: -40°C+125°C; Datasheet: Y:\MIS_DATABASE\DATASHEETS\ICS\DIGITAL\COMBINATIONAL\SN74LVC1G06-SER.PDF; Crtd /date: MAZHAR/170107; Chkd/date: VASANTHA/280616; MECHANICAL 3D STEP FILE: SC70-5_1-1; Library Path: Y:\MIS_DATABASE\Library\ALTIUM_TOOL\SCHEMATICS_PARTS\MS_COMBINATIONAL_Library.schlib; Footprint Path: Y:\MIS_DATABASE\Library\ALTIUM_TOOL\PCB_FOOTPRINTS\Altium_Footprint_Lib.PcbLib